# EasyEDA schematic SCH_Weather Station_2023-01-10.json
TITLE: Weather Station V1; REV: 1.0; Date: 2023-01-06; Sheet: 1/1; Company: Shourov_Paul
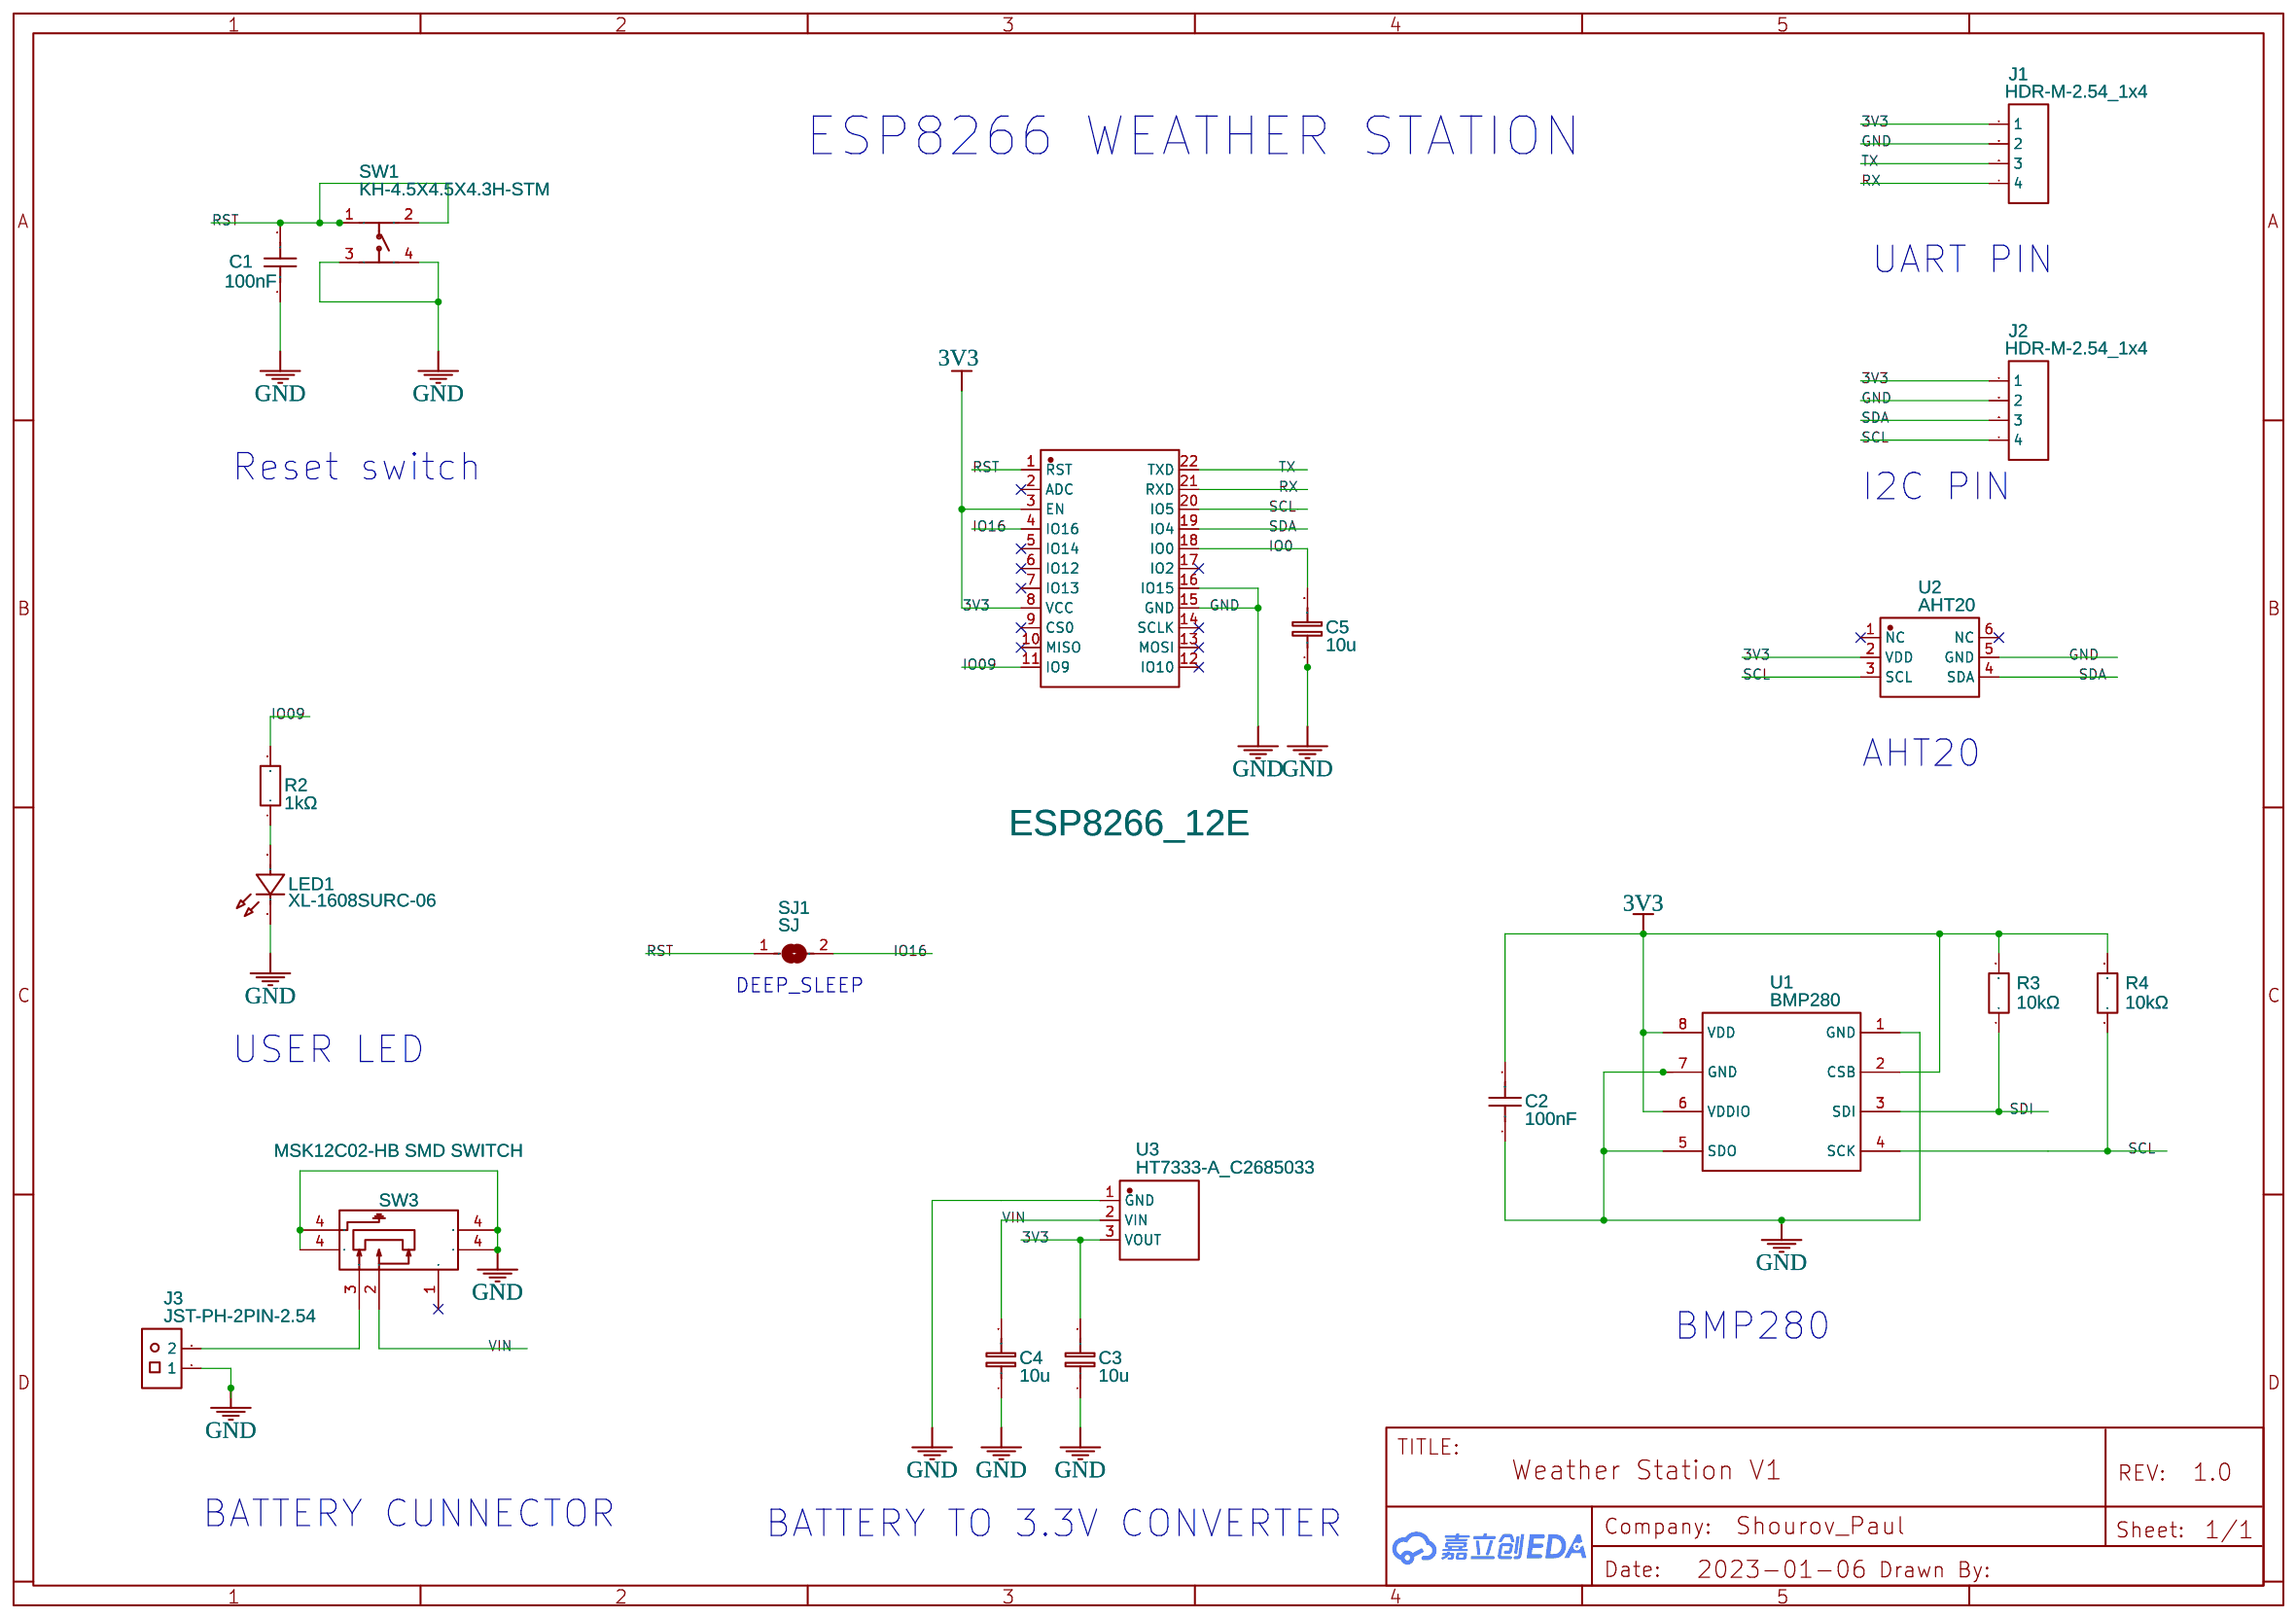
[diagram p0: schematic sheet]

## Parts
C1  100nF  [C0603]
C2  100nF  [C0603]
C3  10u  [C0603]
C4  10u  [C0603]
C5  10u  [C0603]
ESP8266_12E  2.4GHz  [WIFIM-SMD_ESP-12E-BR]
J1  HDR-M-2.54_1x4  [HDR-M-2.54_1X4]
J2  HDR-M-2.54_1x4  [HDR-M-2.54_1X4]
J3  JST-PH-2PIN-2.54  [JST-PH-2PIN-2.54]
LED1  XL-1608SURC-06  [LED0603-RD_RED]
R2  1kΩ  [R0603]
R3  10kΩ  [R0603]
R4  10kΩ  [R0603]
SJ1  SJ  [SJ]
SW1  KH-4.5X4.5X4.3H-STM  [SW-SMD_4P-L4.5-W4.5-P3.00-LS6.8]
SW3  MSK12C02-HB SMD SWITCH  [SW-TH_MSK12C02-HB]
U1  BMP280  [SENSOR-TH_BMP280-BL]
U2  AHT20  [DFN-6_L3.0-W3.0-P1.00-BL]
U3  HT7333-A_C2685033  [SOT-89-3_L4.5-W2.5-P1.50-LS4.1-BR]

## Library data of the parts
C1 C2 = CC0603KRX7R6BB104: Supplier: LCSC; Supplier Part: C519438; Manufacturer: YAGEO(国巨); Contributor: LCSC; JLCPCB Part Class: Extended Part
C3-C5 = C_0603_EU: Contributor: LCEDA_Lib
ESP8266_12E = ESP-12E: Supplier: LCSC; Manufacturer: Ai-Thinker(安信可); Supplier Part: C89297; JLCPCB Part Class: Extended Part
J1 J2 = HDR-M-2.54_1x4: Supplier Part: C124378; Supplier: LCSC; Contributor: LCEDA_Lib
J3 = JST-PH-2PIN-2.54: Contributor: Criterion Tech
LED1 = XL-1608SURC-06: Supplier: LCSC; Supplier Part: C965799; Manufacturer: XINGLIGHT(成兴光); JLCPCB Part Class: Extended Part; Contributor: chengyizhang
R2-R4 = FRC0603J103TS: Supplier: LCSC; Supplier Part: C2930027; Manufacturer: FOJAN(富捷); JLCPCB Part Class: Extended Part; Contributor: LCSC
SJ1 = SJ: Contributor: ERBN
SW1 = KH-4.5X4.5X4.3H-STM: Supplier: LCSC; Supplier Part: C2837550; Manufacturer: kinghelm(金航标); Contributor: LCSC; JLCPCB Part Class: Extended Part
SW3 = MSK12C02-HB SMD SWITCH: Supplier: LCSC; Supplier Part: C431541; Manufacturer: SHOU HAN; Manufacturer Part: MSK12C02-HB; Contributor: LCSC
U1 = BMP280: Supplier: LCSC; Manufacturer: Bosch(博世); Supplier Part: C83291; JLCPCB Part Class: Extended Part
U2 = AHT20: Supplier: LCSC; Supplier Part: C503357; Manufacturer: 广州奥松; Contributor: LCSC; JLCPCB Part Class: Extended Part
U3 = HT7333-A_C2685033: Supplier: LCSC; Supplier Part: C2685033; Manufacturer: 国芯佳品; Manufacturer Part: HT7333-A; Contributor: LCSC; JLCPCB Part Class: Extended Part

## Nets
3V3: C2.2 C3.2 ESP8266_12E.3(EN) ESP8266_12E.8(VCC) J1.1 J2.1 R3.2 R4.2 U1.2(CSB) U1.6(VDDIO) U1.8(VDD) U2.2(VDD) U3.3(VOUT)
GND: C1.1 C2.1 C3.1 C4.1 C5.1 ESP8266_12E.15(GND) ESP8266_12E.16(IO15) J1.2 J2.2 J3.1 LED1.1(K) SW1.3 SW1.4 SW3.4 U1.1(GND) U1.5(SDO) U1.7(GND) U2.5(GND) U3.1(GND)
VIN: C4.2 SW3.2 U3.2(VIN)
IO0: C5.2 ESP8266_12E.18(IO0)
IO09: ESP8266_12E.11(IO9) R2.2
IO16: ESP8266_12E.4(IO16) SJ1.2
RST: C1.2 ESP8266_12E.1(RST) SJ1.1 SW1.1 SW1.2
RX: ESP8266_12E.21(RXD) J1.4
SCL: ESP8266_12E.20(IO5) J2.4 R4.1 U1.4(SCK) U2.3(SCL)
SDA: ESP8266_12E.19(IO4) J2.3 U2.4(SDA)
SDI: R3.1 U1.3(SDI)
TX: ESP8266_12E.22(TXD) J1.3
Net-(J3-2): J3.2 SW3.3
Net-(LED1-2): LED1.2(A) R2.1

Not connected (* = marked no-connect by the designer): ESP8266_12E 2(ADC)* 5(IO14)* 6(IO12)* 7(IO13)* 9(CS0)* 10(MISO)* 12(IO10)* 13(MOSI)* 14(SCLK)* 17(IO2)*; SW3 1*; U2 1(NC)* 6(NC)*

## Notes on the sheet
- ESP8266 WEATHER STATION
- UART PIN
- Reset switch
- I2C PIN
- AHT20
- DEEP_SLEEP
- USER LED
- BMP280
- BATTERY CUNNECTOR
- BATTERY TO 3.3V CONVERTER
